# EAGLE design rotary_break (EAGLE 6.5.0)
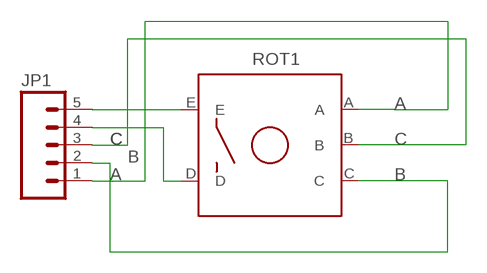
[diagram p0: schematic, sheet 1]

## Parts
JP1  M05PTH  [1X05]
ROT1  ROTENC_EN12_HSROTENC_EN12_HS  [ROTENC_EN12_HS]

## Nets
A: JP1.1 ROT1.A
B: JP1.2 ROT1.C
C: JP1.3 ROT1.B
N$1: JP1.5 ROT1.E
N$2: JP1.4 ROT1.D

## Library data of the parts
JP1 = 1-Generic:M05: Header 5 Standard 5-pin 0.1" header. Use with straight break away headers (SKU : PRT-00116), right angle break away headers (PRT-00553), swiss pins (PRT-00743), machine pins (PRT-00117), and female headers (PRT-00115). Molex polarized connector foot print use with SKU : PRT-08230 with associated crimp pins and housings.
ROT1 = bi-rotencoder:ROTENC_EN12_HS

## Board
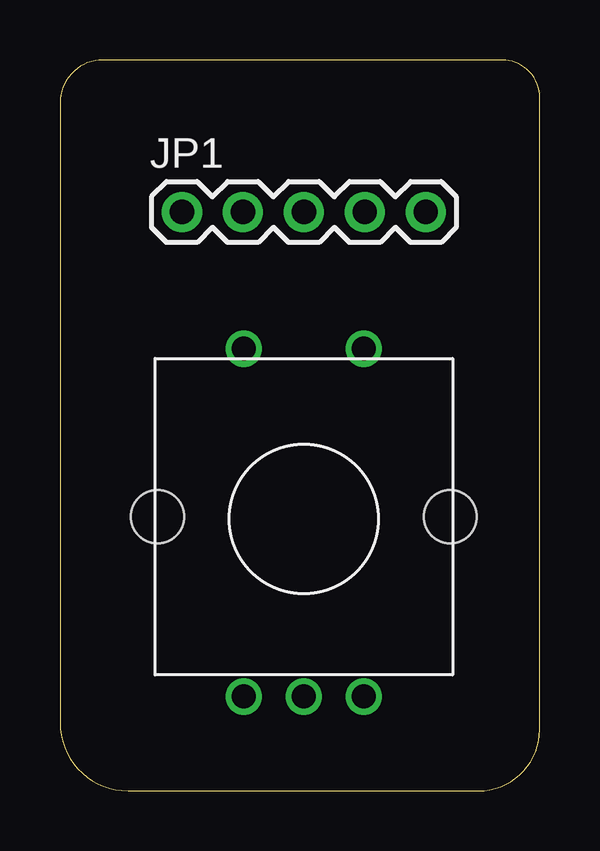
[diagram p1: board, top side]
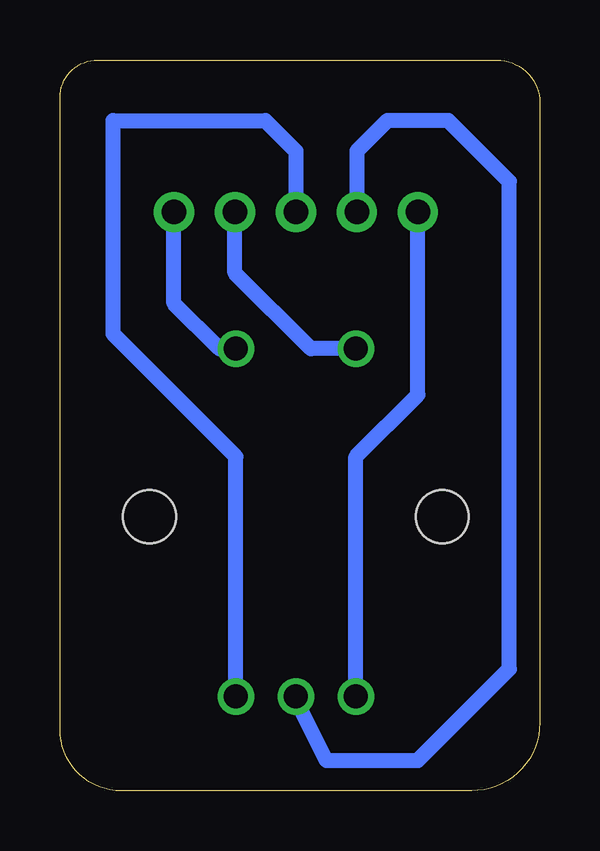
[diagram p2: board, bottom side, seen from below]

Size 19.99 x 30.47 mm. Coordinates in mm from the lower left corner, seen from the top.
Outline: 0,28.68 0,2.84 arc90 2.84,0 17.44,0 arc90 19.99,2.55 19.99,28.9 arc90 18.42,30.47 1.79,30.47 arc90 0,28.68
Copper layers (1*16): Top 0.035mm / dielectric 1.5mm / Bottom 0.035mm
Design rules "Othermill-DRC-1-32": minimum track width 8mil, minimum drill 0.8mm, track to track 0.794003125mm, track to pad 0.794003125mm, pad to pad 0.794003125mm, via to via 0.794003125mm, smd to smd 0mil, copper to edge 0mil, drill to drill 1mil, minimum pad ring 10mil, minimum via ring 10mil, stop-mask expansion 1mil, vias tented up to drill 30mil, thermal gap 10mil

### Footprints (pad centres in the part's own frame; a part is rotated, then mirrored left to right if it is on the bottom)
1X05 = drill 1.016 pad 1.676: 1 0,0; 2 2.54,0; 3 5.08,0; 4 7.62,0; 5 10.16,0
ROTENC_EN12_HS = drill 1: A -2.5,-7.5; B 2.5,-7.5; C 0,-7.5; D -2.5,7; E 2.5,7 | hole 2.2: -6.1,0; 6.1,0

### Placement (x,y rotation side)
JP1  5.08,24.13 0 top
ROT1  10.16,11.43 0 top

### Tracks (layer width: path | path; a pad name or v marks a point on that pad's centre or on a via)
A
  Bottom 0.635: ROT1.A 7.66,13.93 5.08,16.51 JP1.1
B
  Bottom 0.406: ROT1.C 10.16,3.81
  Bottom 0.635: 10.16,3.81 8.89,1.27 5.08,1.27 1.27,5.08 1.27,25.4 3.81,27.94 6.35,27.94 7.62,26.67 JP1.2
C
  Bottom 0.635: ROT1.B 12.66,13.93 17.78,19.05 17.78,27.94 11.43,27.94 10.16,26.67 JP1.3
N$1
  Bottom 0.635: ROT1.E 13.35,18.43 15.24,20.32 JP1.5
N$2
  Bottom 0.635: ROT1.D 9.54,18.43 12.7,21.59 JP1.4